# Altium schematic sheet [05] - Motors.SchDoc
size A4
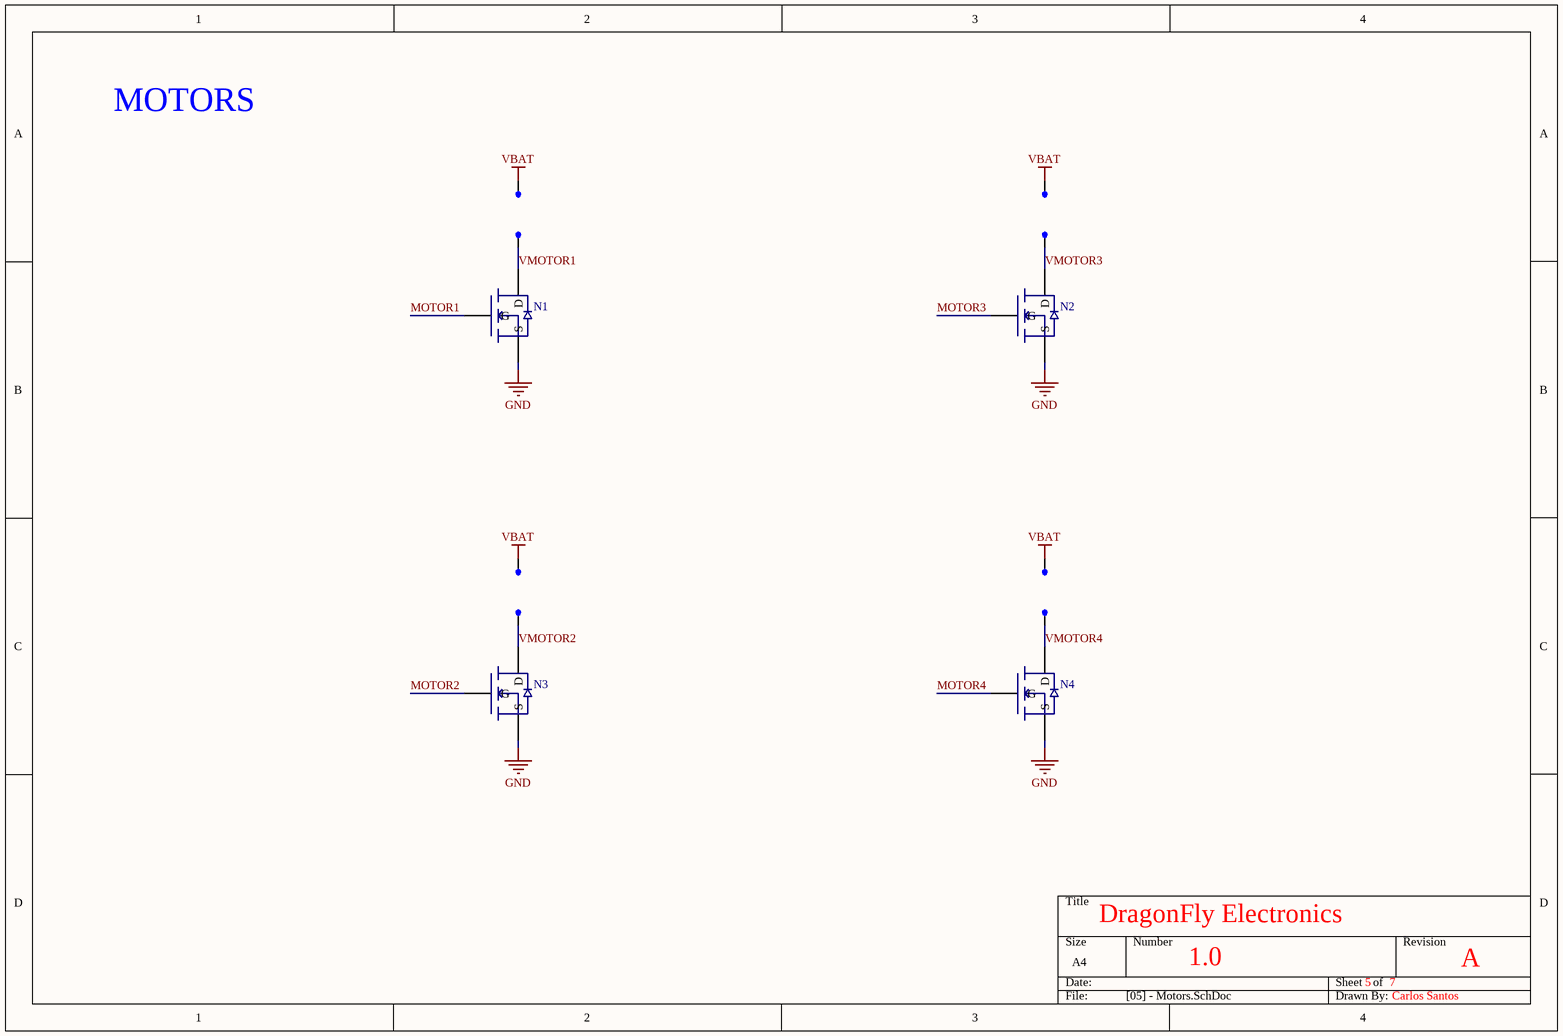
[diagram p0: [05] - Motors.SchDoc]

## Parts
N1  N-MOSFET  [DFN1006-3]  (value not drawn)
N2  N-MOSFET  [DFN1006-3]  (value not drawn)
N3  N-MOSFET  [DFN1006-3]  (value not drawn)
N4  N-MOSFET  [DFN1006-3]  (value not drawn)
SP1  Signal Point  [Signal_point_2mm]  (value not drawn)
SP2  Signal Point  [Signal_point_2mm]  (value not drawn)
SP3  Signal Point  [Signal_point_2mm]  (value not drawn)
SP4  Signal Point  [Signal_point_2mm]  (value not drawn)
SP5  Signal Point  [Signal_point_2mm]  (value not drawn)
SP6  Signal Point  [Signal_point_2mm]  (value not drawn)
SP7  Signal Point  [Signal_point_2mm]  (value not drawn)
SP8  Signal Point  [Signal_point_2mm]  (value not drawn)

## Nets
GND: N1.1(S) N2.1(S) N3.1(S) N4.1(S)
VBAT: SP1.0(VIN) SP2.0(VIN) SP5.0(VIN) SP6.0(VIN)
MOTOR1: N1.2(G)
MOTOR2: N3.2(G)
MOTOR3: N2.2(G)
MOTOR4: N4.2(G)
VMOTOR1: N1.3(D) SP3.0(VIN)
VMOTOR2: N3.3(D) SP7.0(VIN)
VMOTOR3: N2.3(D) SP4.0(VIN)
VMOTOR4: N4.3(D) SP8.0(VIN)

## Notes on the sheet
- MOTORS
- DragonFly Electronics
- 1.0
- 5
- 7
- A
- Carlos Santos

## Library data of the parts
SP1-SP8 = Signal Point: Value: DNP
N1-N4 = N-MOSFET: DigiKey Part #: 1727-2316-1-ND